# Altium schematic sheet 0_architecture.schdoc: Block diagram
size A3; DrawnBy: Sara V. Martínez; Engineer: Flight; DocumentNumber: 1; Revision: v0.3; SheetNumber: 1; SheetTotal: 11; Designed by: Andre M. P. Mattos; ProjectRevision: v0.3
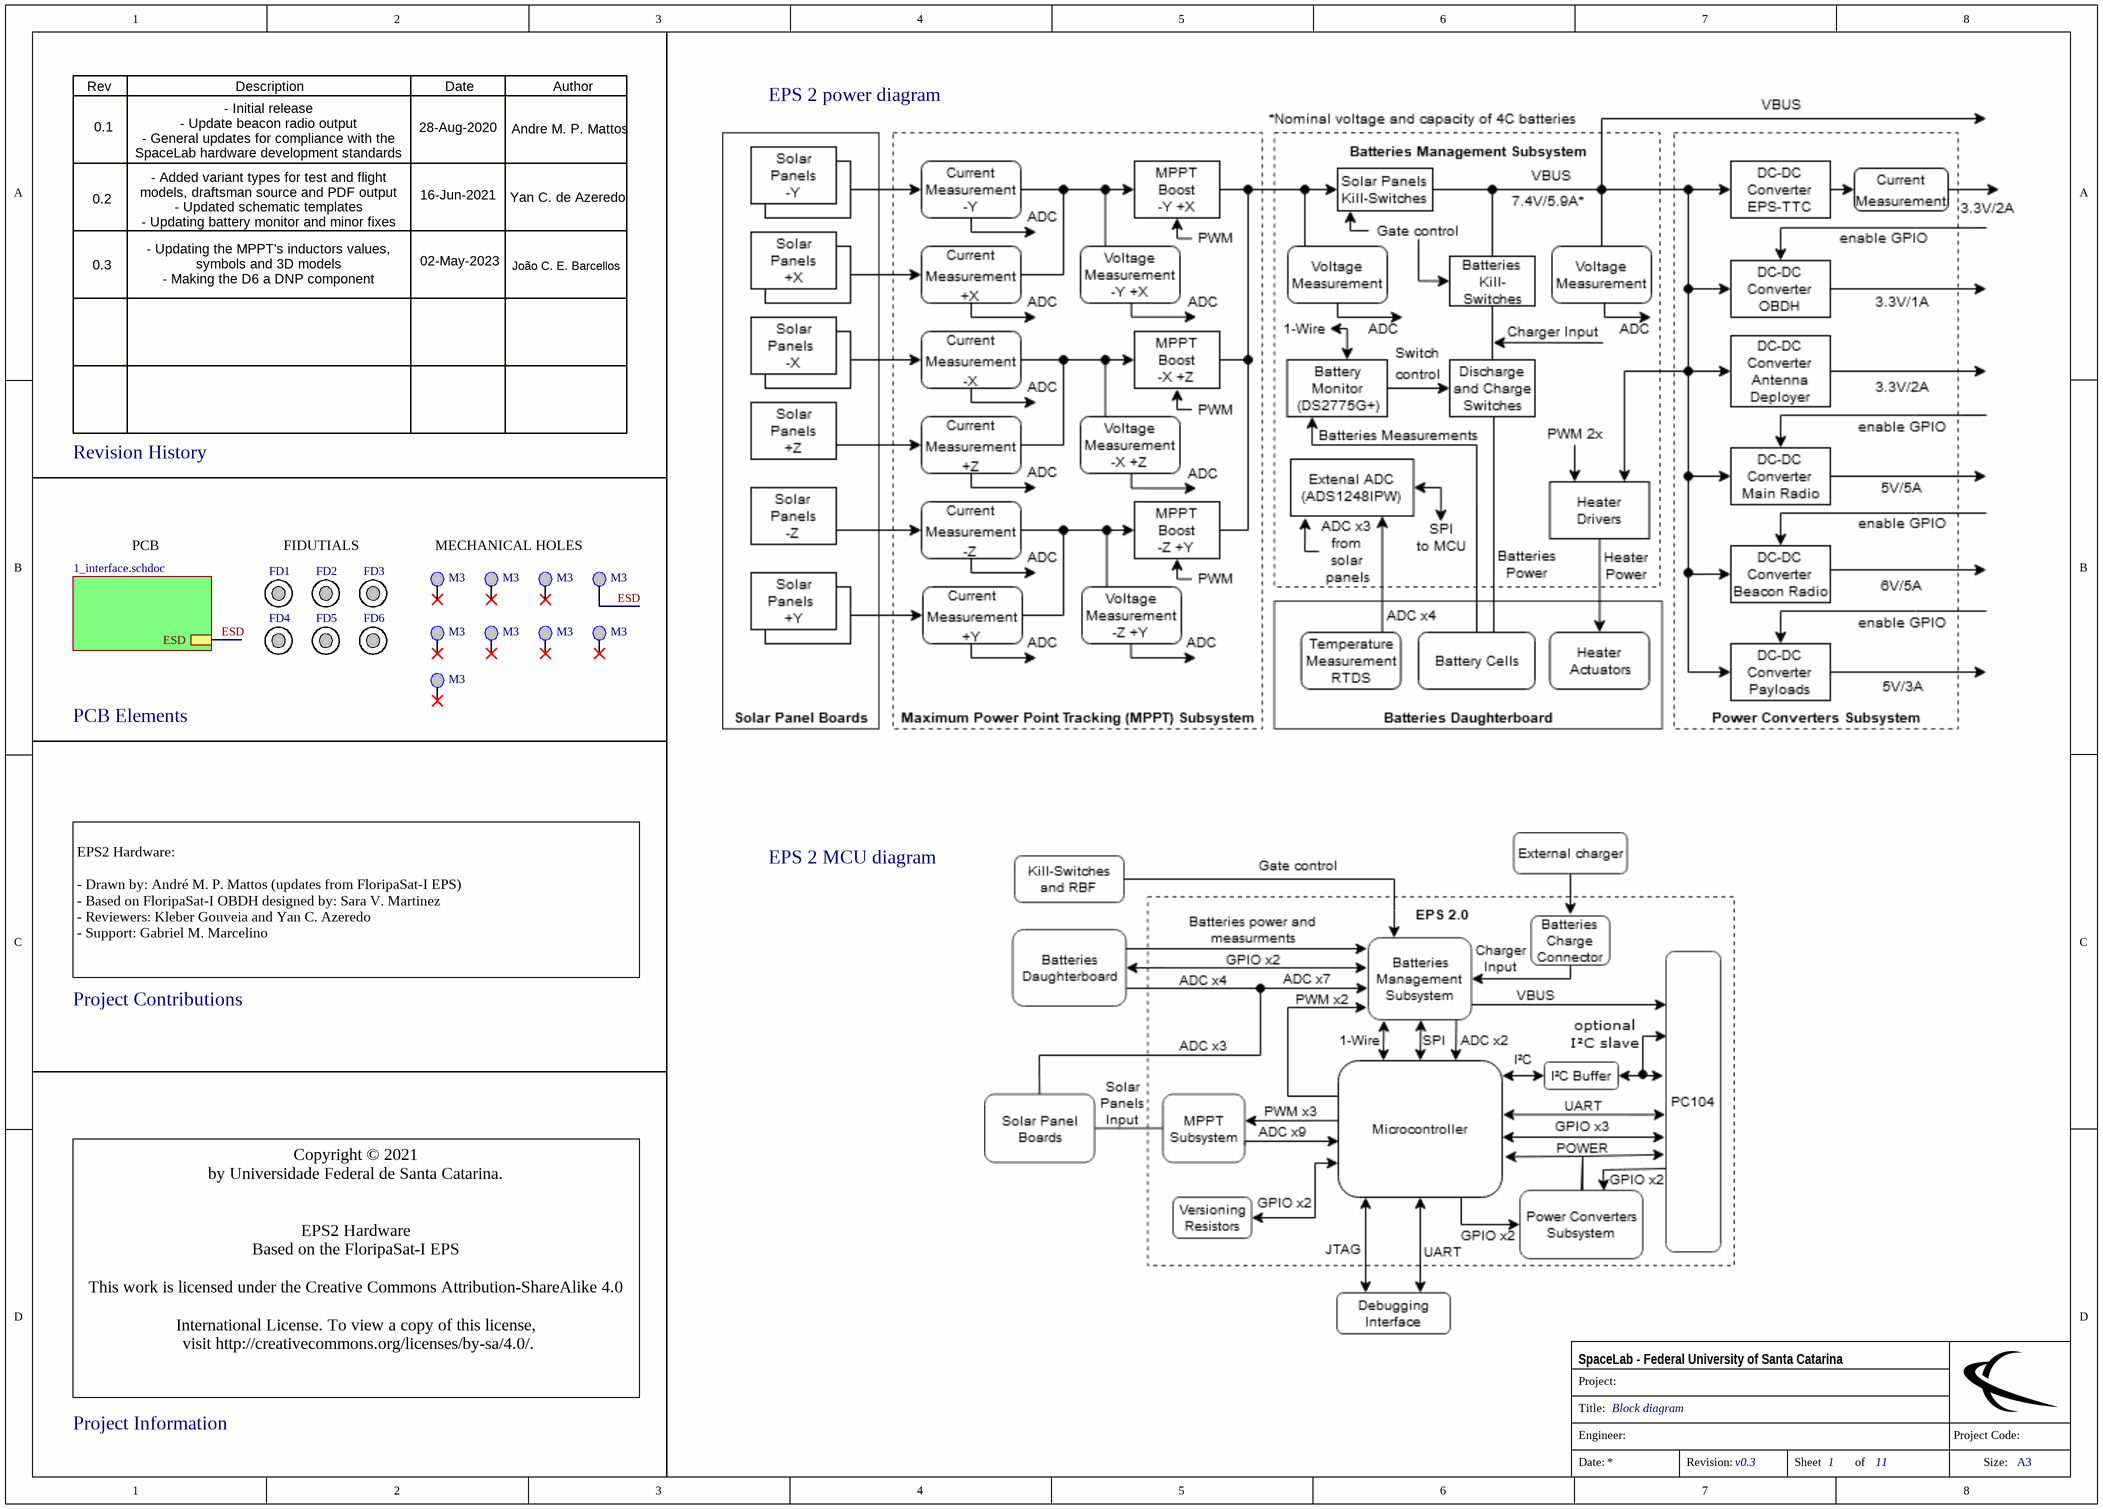
[diagram p0: 0_architecture.schdoc]

## Parts
FD1  Fiducial 1.3  [Fiducial 1.3mm]  (value not drawn)  (no BOM)
FD2  Fiducial 1.3  [Fiducial 1.3mm]  (value not drawn)  (no BOM)
FD3  Fiducial 1.3  [Fiducial 1.3mm]  (value not drawn)  (no BOM)
FD4  Fiducial 1.3  [Fiducial 1.3mm]  (value not drawn)  (no BOM)
FD5  Fiducial 1.3  [Fiducial 1.3mm]  (value not drawn)  (no BOM)
FD6  Fiducial 1.3  [Fiducial 1.3mm]  (value not drawn)  (no BOM)
MEC1  M3  [M3 hole]  (no BOM)
MEC2  M3  [M3 hole]  (no BOM)
MEC3  M3  [M3 hole]  (no BOM)
MEC4  M3  [M3 hole]  (no BOM)
MEC5  M3  [M3 hole]  (no BOM)
MEC6  M3  [M3 hole]  (no BOM)
MEC7  M3  [M3 hole]  (no BOM)
MEC8  M3  [M3 hole]  (no BOM)
MEC9  M3  [M3 hole]  (no BOM)

## Sub-sheets
Interface = 1_interface.schdoc: ESD

## Nets
ESD: MEC4.0 ; sheet Interface/ESD

Not connected (* = marked no-connect by the designer): MEC1 0*; MEC2 0*; MEC3 0*; MEC5 0*; MEC6 0*; MEC7 0*; MEC8 0*; MEC9 0*

## Notes on the sheet
- Rev
- Description
- Date
- Author
- EPS 2 power diagram
- 0.1
- - Initial release
  - Update beacon radio output
  - General updates for compliance with the SpaceLab hardware development standards
- 28-Aug-2020
- Andre M. P. Mattos
- 0.2
- - Added variant types for test and flight models, draftsman source and PDF output
  - Updated schematic templates
  - Updating battery monitor and minor fixes
- 16-Jun-2021
- Yan C. de Azeredo
- 0.3
- - Updating the MPPT's inductors values, symbols and 3D models
  - Making the D6 a DNP component
- 02-May-2023
- João C. E. Barcellos
- Revision History
- PCB
- FIDUTIALS
- MECHANICAL HOLES
- PCB Elements
- EPS 2 MCU diagram
- EPS2 Hardware:
  - Drawn by: André M. P. Mattos (updates from FloripaSat-I EPS)
  - Based on FloripaSat-I OBDH designed by: Sara V. Martinez
  - Reviewers: Kleber Gouveia and Yan C. Azeredo
  - Support: Gabriel M. Marcelino
- Project Contributions
- Copyright © 2021
  by Universidade Federal de Santa Catarina.
  EPS2 Hardware
  Based on the FloripaSat-I EPS
  This work is licensed under the Creative Commons Attribution-ShareAlike 4.0
  International License. To view a copy of this license,
  visit http://creativecommons.org/licenses/by-sa/4.0/.
  Github repository: https://github.com/spacelab-ufsc/eps2
  More info about SpaceLab: https://spacelab.ufsc.br/
- Project Information
- Project:
- SpaceLab - Federal University of Santa Catarina
- Title:
- Engineer:
- Project Code:
- Date:
- Revision:
- Sheet
- of
- Size:
- A3

## Library data of the parts
FD1-FD6 = Fiducial 1.3: Fiducial 1.3mm
MEC1-MEC9 = M3 hole